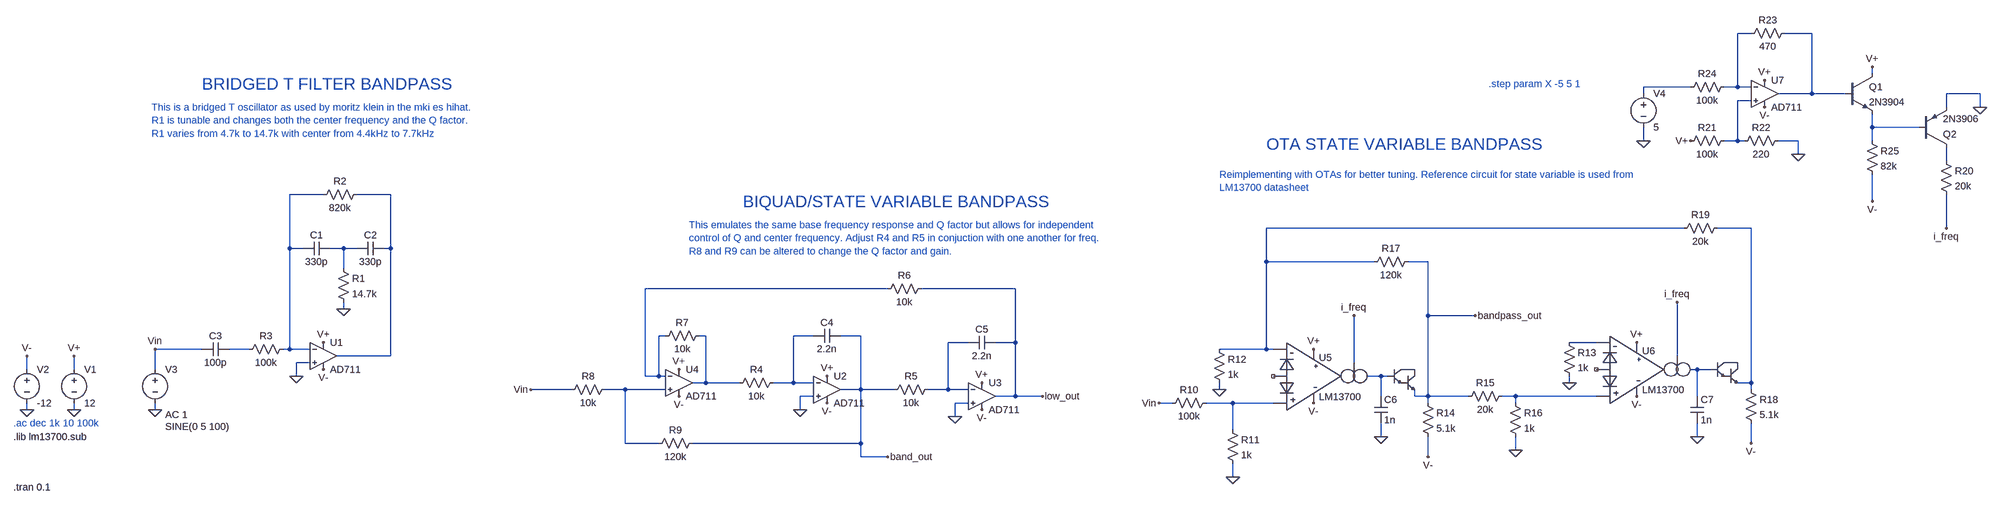
[diagram p0: schematic bandpass.asc]
bandpass.asc, the LTspice schematic file:
Version 4
SHEET 1 5156 680
WIRE 4272 -688 4240 -688
WIRE 4416 -688 4352 -688
WIRE 4560 -592 4560 -608
WIRE 4128 -560 4016 -560
WIRE 4240 -560 4240 -688
WIRE 4240 -560 4208 -560
WIRE 4272 -560 4240 -560
WIRE 4016 -544 4016 -560
WIRE 4416 -544 4416 -688
WIRE 4416 -544 4336 -544
WIRE 4496 -544 4416 -544
WIRE 4816 -544 4736 -544
WIRE 4272 -528 4240 -528
WIRE 4736 -512 4736 -544
WIRE 4816 -512 4816 -544
WIRE 4560 -464 4560 -496
WIRE 4672 -464 4560 -464
WIRE 4016 -432 4016 -464
WIRE 4240 -432 4240 -528
WIRE 4240 -432 4208 -432
WIRE 4256 -432 4240 -432
WIRE 4384 -432 4336 -432
WIRE 4560 -432 4560 -464
WIRE 4384 -400 4384 -432
WIRE 4736 -384 4736 -416
WIRE 528 -304 448 -304
WIRE 688 -304 608 -304
WIRE 4560 -288 4560 -352
WIRE 4112 -224 3120 -224
WIRE 4272 -224 4192 -224
WIRE 4736 -224 4736 -304
WIRE 448 -176 448 -304
WIRE 480 -176 448 -176
WIRE 576 -176 544 -176
WIRE 608 -176 576 -176
WIRE 688 -176 688 -304
WIRE 688 -176 672 -176
WIRE 3120 -144 3120 -224
WIRE 3376 -144 3120 -144
WIRE 3504 -144 3456 -144
WIRE 576 -128 576 -176
WIRE 2016 -80 1440 -80
WIRE 2320 -80 2096 -80
WIRE 576 -32 576 -48
WIRE 3504 -16 3504 -144
WIRE 3616 -16 3504 -16
WIRE 1488 32 1472 32
WIRE 1584 32 1568 32
WIRE 1840 32 1792 32
WIRE 1952 32 1904 32
WIRE 2208 48 2160 48
WIRE 2320 48 2320 -80
WIRE 2320 48 2272 48
WIRE 3904 48 3840 48
WIRE 240 64 128 64
WIRE 352 64 304 64
WIRE 448 64 448 -176
WIRE 448 64 432 64
WIRE 496 64 448 64
WIRE 3120 64 3120 -144
WIRE 3120 64 3008 64
WIRE 3136 64 3120 64
WIRE 688 80 688 -176
WIRE 688 80 560 80
WIRE 4096 80 4096 -48
WIRE 496 96 464 96
WIRE 3328 96 3328 -16
WIRE -240 112 -240 80
WIRE -128 112 -128 80
WIRE 128 112 128 64
WIRE 4144 112 4128 112
WIRE 4176 112 4144 112
WIRE 464 128 464 96
WIRE 1440 128 1440 -80
WIRE 1472 128 1472 32
WIRE 1472 128 1440 128
WIRE 1488 128 1472 128
WIRE 3392 128 3360 128
WIRE 3408 128 3392 128
WIRE 1584 144 1584 32
WIRE 1584 144 1552 144
WIRE 1664 144 1584 144
WIRE 1792 144 1792 32
WIRE 1792 144 1744 144
WIRE 1840 144 1792 144
WIRE 3840 144 3840 128
WIRE 4272 144 4272 -224
WIRE 4272 144 4240 144
WIRE 1264 160 1168 160
WIRE 1392 160 1344 160
WIRE 1488 160 1392 160
WIRE 1952 160 1952 32
WIRE 1952 160 1904 160
WIRE 2032 160 1952 160
WIRE 2160 160 2160 48
WIRE 2160 160 2112 160
WIRE 2208 160 2160 160
WIRE 3008 160 3008 144
WIRE 4272 160 4272 144
WIRE 1840 176 1808 176
WIRE 2320 176 2320 48
WIRE 2320 176 2272 176
WIRE 2384 176 2320 176
WIRE 3392 176 3392 128
WIRE 3472 176 3472 160
WIRE 3504 176 3504 -16
WIRE 3504 176 3472 176
WIRE 3600 176 3504 176
WIRE 3712 176 3680 176
WIRE 3904 176 3712 176
WIRE 4144 176 4144 112
WIRE 2208 192 2176 192
WIRE 2896 192 2864 192
WIRE 3040 192 2976 192
WIRE 3136 192 3040 192
WIRE 3504 192 3504 176
WIRE 3712 192 3712 176
WIRE -240 208 -240 192
WIRE -128 208 -128 192
WIRE 128 208 128 192
WIRE 1808 208 1808 176
WIRE 2176 224 2176 192
WIRE 3040 256 3040 192
WIRE 3392 272 3392 240
WIRE 4144 272 4144 240
WIRE 1392 288 1392 160
WIRE 1472 288 1392 288
WIRE 1952 288 1952 160
WIRE 1952 288 1552 288
WIRE 4272 288 4272 240
WIRE 3712 304 3712 272
WIRE 1952 320 1952 288
WIRE 2016 320 1952 320
WIRE 3504 320 3504 272
WIRE 3040 368 3040 336
FLAG -240 208 0
FLAG -128 208 0
FLAG -240 80 V-
FLAG -128 80 V+
FLAG 128 208 0
FLAG 576 -32 0
FLAG 528 48 V+
FLAG 528 112 V-
FLAG 464 128 0
FLAG 1872 128 V+
FLAG 1872 192 V-
FLAG 1808 208 0
FLAG 2240 144 V+
FLAG 2240 208 V-
FLAG 2176 224 0
FLAG 1520 176 V-
FLAG 1520 112 V+
FLAG 2016 320 band_out
FLAG 2384 176 low_out
FLAG 128 64 Vin
FLAG 1168 160 Vin
FLAG 3040 368 0
FLAG 2864 192 Vin
FLAG 3008 160 0
FLAG 3232 64 V+
FLAG 3232 192 V-
FLAG 3328 -16 i_freq
FLAG 4096 -48 i_freq
FLAG 4000 48 V+
FLAG 4000 176 V-
FLAG 3840 144 0
FLAG 3392 272 0
FLAG 3504 320 V-
FLAG 3712 304 0
FLAG 4144 272 0
FLAG 4272 288 V-
FLAG 4736 -224 i_freq
FLAG 3616 -16 bandpass_out
FLAG 4304 -576 V+
FLAG 4016 -432 0
FLAG 4384 -400 0
FLAG 4128 -432 V+
FLAG 4304 -512 V-
FLAG 4560 -288 V-
FLAG 4560 -608 V+
FLAG 4816 -512 0
SYMBOL voltage -128 96 R0
WINDOW 123 0 0 Left 0
WINDOW 39 0 0 Left 0
SYMATTR InstName V1
SYMATTR Value 12
SYMBOL voltage -240 96 R0
WINDOW 123 0 0 Left 0
WINDOW 39 0 0 Left 0
SYMATTR InstName V2
SYMATTR Value -12
SYMBOL voltage 128 96 R0
WINDOW 123 24 124 Left 2
WINDOW 39 0 0 Left 0
WINDOW 3 24 152 Left 2
SYMATTR Value2 AC 1
SYMATTR Value SINE(0 5 100)
SYMATTR InstName V3
SYMBOL cap 544 -192 R90
WINDOW 0 0 32 VBottom 2
WINDOW 3 32 32 VTop 2
SYMATTR InstName C1
SYMATTR Value 330p
SYMBOL cap 672 -192 R90
WINDOW 0 0 32 VBottom 2
WINDOW 3 32 32 VTop 2
SYMATTR InstName C2
SYMATTR Value 330p
SYMBOL res 560 -144 R0
SYMATTR InstName R1
SYMATTR Value 14.7k
SYMBOL res 624 -320 R90
WINDOW 0 0 56 VBottom 2
WINDOW 3 32 56 VTop 2
SYMATTR InstName R2
SYMATTR Value 820k
SYMBOL OpAmps\\AD711 528 16 R0
SYMATTR InstName U1
SYMBOL cap 304 48 R90
WINDOW 0 0 32 VBottom 2
WINDOW 3 32 32 VTop 2
SYMATTR InstName C3
SYMATTR Value 100p
SYMBOL res 448 48 R90
WINDOW 0 0 56 VBottom 2
WINDOW 3 32 56 VTop 2
SYMATTR InstName R3
SYMATTR Value 100k
SYMBOL OpAmps\\AD711 1872 96 R0
SYMATTR InstName U2
SYMBOL res 1760 128 R90
WINDOW 0 0 56 VBottom 2
WINDOW 3 32 56 VTop 2
SYMATTR InstName R4
SYMATTR Value 10k
SYMBOL cap 1904 16 R90
WINDOW 0 0 32 VBottom 2
WINDOW 3 32 32 VTop 2
SYMATTR InstName C4
SYMATTR Value 2.2n
SYMBOL OpAmps\\AD711 2240 112 R0
SYMATTR InstName U3
SYMBOL res 2128 144 R90
WINDOW 0 0 56 VBottom 2
WINDOW 3 32 56 VTop 2
SYMATTR InstName R5
SYMATTR Value 10k
SYMBOL cap 2272 32 R90
WINDOW 0 0 32 VBottom 2
WINDOW 3 32 32 VTop 2
SYMATTR InstName C5
SYMATTR Value 2.2n
SYMBOL OpAmps\\AD711 1520 80 R0
SYMATTR InstName U4
SYMBOL res 2112 -96 R90
WINDOW 0 0 56 VBottom 2
WINDOW 3 32 56 VTop 2
SYMATTR InstName R6
SYMATTR Value 10k
SYMBOL res 1584 16 R90
WINDOW 0 0 56 VBottom 2
WINDOW 3 32 56 VTop 2
SYMATTR InstName R7
SYMATTR Value 10k
SYMBOL res 1360 144 R90
WINDOW 0 0 56 VBottom 2
WINDOW 3 32 56 VTop 2
SYMATTR InstName R8
SYMATTR Value 10k
SYMBOL res 1568 272 R90
WINDOW 0 0 56 VBottom 2
WINDOW 3 32 56 VTop 2
SYMATTR InstName R9
SYMATTR Value 120k
SYMBOL res 2992 176 R90
WINDOW 0 0 56 VBottom 2
WINDOW 3 32 56 VTop 2
SYMATTR InstName R10
SYMATTR Value 100k
SYMBOL res 3024 240 R0
SYMATTR InstName R11
SYMATTR Value 1k
SYMBOL res 2992 48 R0
SYMATTR InstName R12
SYMATTR Value 1k
SYMBOL res 3824 32 R0
SYMATTR InstName R13
SYMATTR Value 1k
SYMBOL cap 3376 176 R0
SYMATTR InstName C6
SYMATTR Value 1n
SYMBOL res 3488 176 R0
SYMATTR InstName R14
SYMATTR Value 5.1k
SYMBOL res 3696 160 R90
WINDOW 0 0 56 VBottom 2
WINDOW 3 32 56 VTop 2
SYMATTR InstName R15
SYMATTR Value 20k
SYMBOL res 3696 176 R0
SYMATTR InstName R16
SYMATTR Value 1k
SYMBOL res 3472 -160 R90
WINDOW 0 0 56 VBottom 2
WINDOW 3 32 56 VTop 2
SYMATTR InstName R17
SYMATTR Value 120k
SYMBOL cap 4128 176 R0
SYMATTR InstName C7
SYMATTR Value 1n
SYMBOL res 4256 144 R0
SYMATTR InstName R18
SYMATTR Value 5.1k
SYMBOL res 4208 -240 R90
WINDOW 0 0 56 VBottom 2
WINDOW 3 32 56 VTop 2
SYMATTR InstName R19
SYMATTR Value 20k
SYMBOL res 4720 -400 R0
SYMATTR InstName R20
SYMATTR Value 20k
SYMBOL LM13700 3200 48 R0
SYMATTR InstName U5
SYMBOL LM13700 3968 32 R0
SYMATTR InstName U6
SYMBOL OpAmps\\AD711 4304 -608 R0
SYMATTR InstName U7
SYMBOL res 4224 -448 R90
WINDOW 0 0 56 VBottom 2
WINDOW 3 32 56 VTop 2
SYMATTR InstName R21
SYMATTR Value 100k
SYMBOL res 4368 -704 R90
WINDOW 0 0 56 VBottom 2
WINDOW 3 32 56 VTop 2
SYMATTR InstName R23
SYMATTR Value 470
SYMBOL res 4224 -576 R90
WINDOW 0 0 56 VBottom 2
WINDOW 3 32 56 VTop 2
SYMATTR InstName R24
SYMATTR Value 100k
SYMBOL npn 4496 -592 R0
SYMATTR InstName Q1
SYMATTR Value 2N3904
SYMBOL res 4544 -448 R0
SYMATTR InstName R25
SYMATTR Value 82k
SYMBOL pnp 4672 -416 M180
SYMATTR InstName Q2
SYMATTR Value 2N3906
SYMBOL voltage 4016 -560 R0
WINDOW 123 0 0 Left 0
WINDOW 39 0 0 Left 0
SYMATTR InstName V4
SYMATTR Value 5
SYMBOL res 4352 -448 R90
WINDOW 0 0 56 VBottom 2
WINDOW 3 32 56 VTop 2
SYMATTR InstName R22
SYMATTR Value 220
TEXT -272 240 Left 2 ;.ac dec 1k 10 100k
TEXT 120 -512 Left 2 ;This is a bridged T oscillator as used by moritz klein in the mki es hihat. \nR1 is tunable and changes both the center frequency and the Q factor.\nR1 varies from 4.7k to 14.7k with center from 4.4kHz to 7.7kHz
TEXT 240 -568 Left 4 ;BRIDGED T FILTER BANDPASS
TEXT 1672 -288 Left 4 ;BIQUAD/STATE VARIABLE BANDPASS
TEXT 1544 -232 Left 2 ;This emulates the same base frequency response and Q factor but allows for independent \ncontrol of Q and center frequency. Adjust R4 and R5 in conjuction with one another for freq.\nR8 and R9 can be altered to change the Q factor and gain.
TEXT 3120 -424 Left 4 ;OTA STATE VARIABLE BANDPASS
TEXT 3008 -352 Left 2 ;Reimplementing with OTAs for better tuning. Reference circuit for state variable is used from \nLM13700 datasheet
TEXT -272 272 Left 2 !.lib lm13700.sub
TEXT -272 392 Left 2 !.tran 0.1
TEXT 3648 -568 Left 2 ;.step param X -5 5 1

The netlist it stands for:
* bandpass.asc
V1 V+ 0 12
V2 V- 0 -12
V3 Vin 0 SINE(0 5 100) AC 1
C1 N011 N007 330p
C2 N008 N011 330p
R1 N011 0 14.7k
R2 N008 N007 820k
XU1 0 N007 V+ V- N008 AD712  ; AD711, pins In+ In- V+ V- OUT
C3 N017 Vin 100p
R3 N007 N017 100k
XU2 0 N014 V+ V- band_out AD712  ; AD711, pins In+ In- V+ V- OUT
R4 N014 N013 10k
C4 band_out N014 2.2n
XU3 0 N015 V+ V- low_out AD712  ; AD711, pins In+ In- V+ V- OUT
R5 N015 band_out 10k
C5 low_out N015 2.2n
XU4 N020 N012 V+ V- N013 AD712  ; AD711, pins In+ In- V+ V- OUT
R6 low_out N012 10k
R7 N013 N012 10k
R8 N020 Vin 10k
R9 band_out N020 120k
R10 N022 Vin 100k
R11 N022 0 1k
R12 N009 0 1k
R13 N016 0 1k
C6 N019 0 1n
R14 bandpass_out V- 5.1k
R15 N021 bandpass_out 20k
R16 N021 0 1k
R17 bandpass_out N009 120k
C7 N018 0 1n
R18 N010 V- 5.1k
R19 N010 N009 20k
R20 N006 i_freq 20k
XU5 NC_01 N022 N009 i_freq N019 V+ V- N019 bandpass_out LM13700 HALF13700  ; pins LIN INP INN IAB ? VCC VSS BIN BUF
XU6 NC_02 N021 N016 i_freq N018 V+ V- N018 N010 LM13700 HALF13700  ; pins LIN INP INN IAB ? VCC VSS BIN BUF
XU7 N004 N001 V+ V- N002 AD712  ; AD711, pins In+ In- V+ V- OUT
R21 N004 V+ 100k
R23 N002 N001 470
R24 N001 N003 100k
Q1 V+ N002 N005 0 2N3904
R25 N005 V- 82k
Q2 N006 N005 0 0 2N3906
V4 N003 0 5
R22 0 N004 220
.model NPN NPN
.model PNP PNP
.lib standard.bjt
* .ac dec 1k 10 100k
* This is a bridged T oscillator as used by moritz klein in the mki es hihat.
* R1 is tunable and changes both the center frequency and the Q factor.
* R1 varies from 4.7k to 14.7k with center from 4.4kHz to 7.7kHz
* BRIDGED T FILTER BANDPASS
* BIQUAD/STATE VARIABLE BANDPASS
* This emulates the same base frequency response and Q factor but allows for independent
* control of Q and center frequency. Adjust R4 and R5 in conjuction with one another for freq.
* R8 and R9 can be altered to change the Q factor and gain.
* OTA STATE VARIABLE BANDPASS
* Reimplementing with OTAs for better tuning. Reference circuit for state variable is used from
* LM13700 datasheet
.lib lm13700.sub
.tran 0.1
* .step param X -5 5 1
.lib ADI1.lib
.backanno
.end